# Altium schematic sheet STM32F7.SchDoc: STM32F723e Connexion
size A3; Author: N.P; CompanyName: STMicroelectronics; Organization: MCD/APPLIS/LMS; DocumentNumber: 4; SheetNumber: 4; SheetTotal: 13; Project: STM32F723e-DISCO
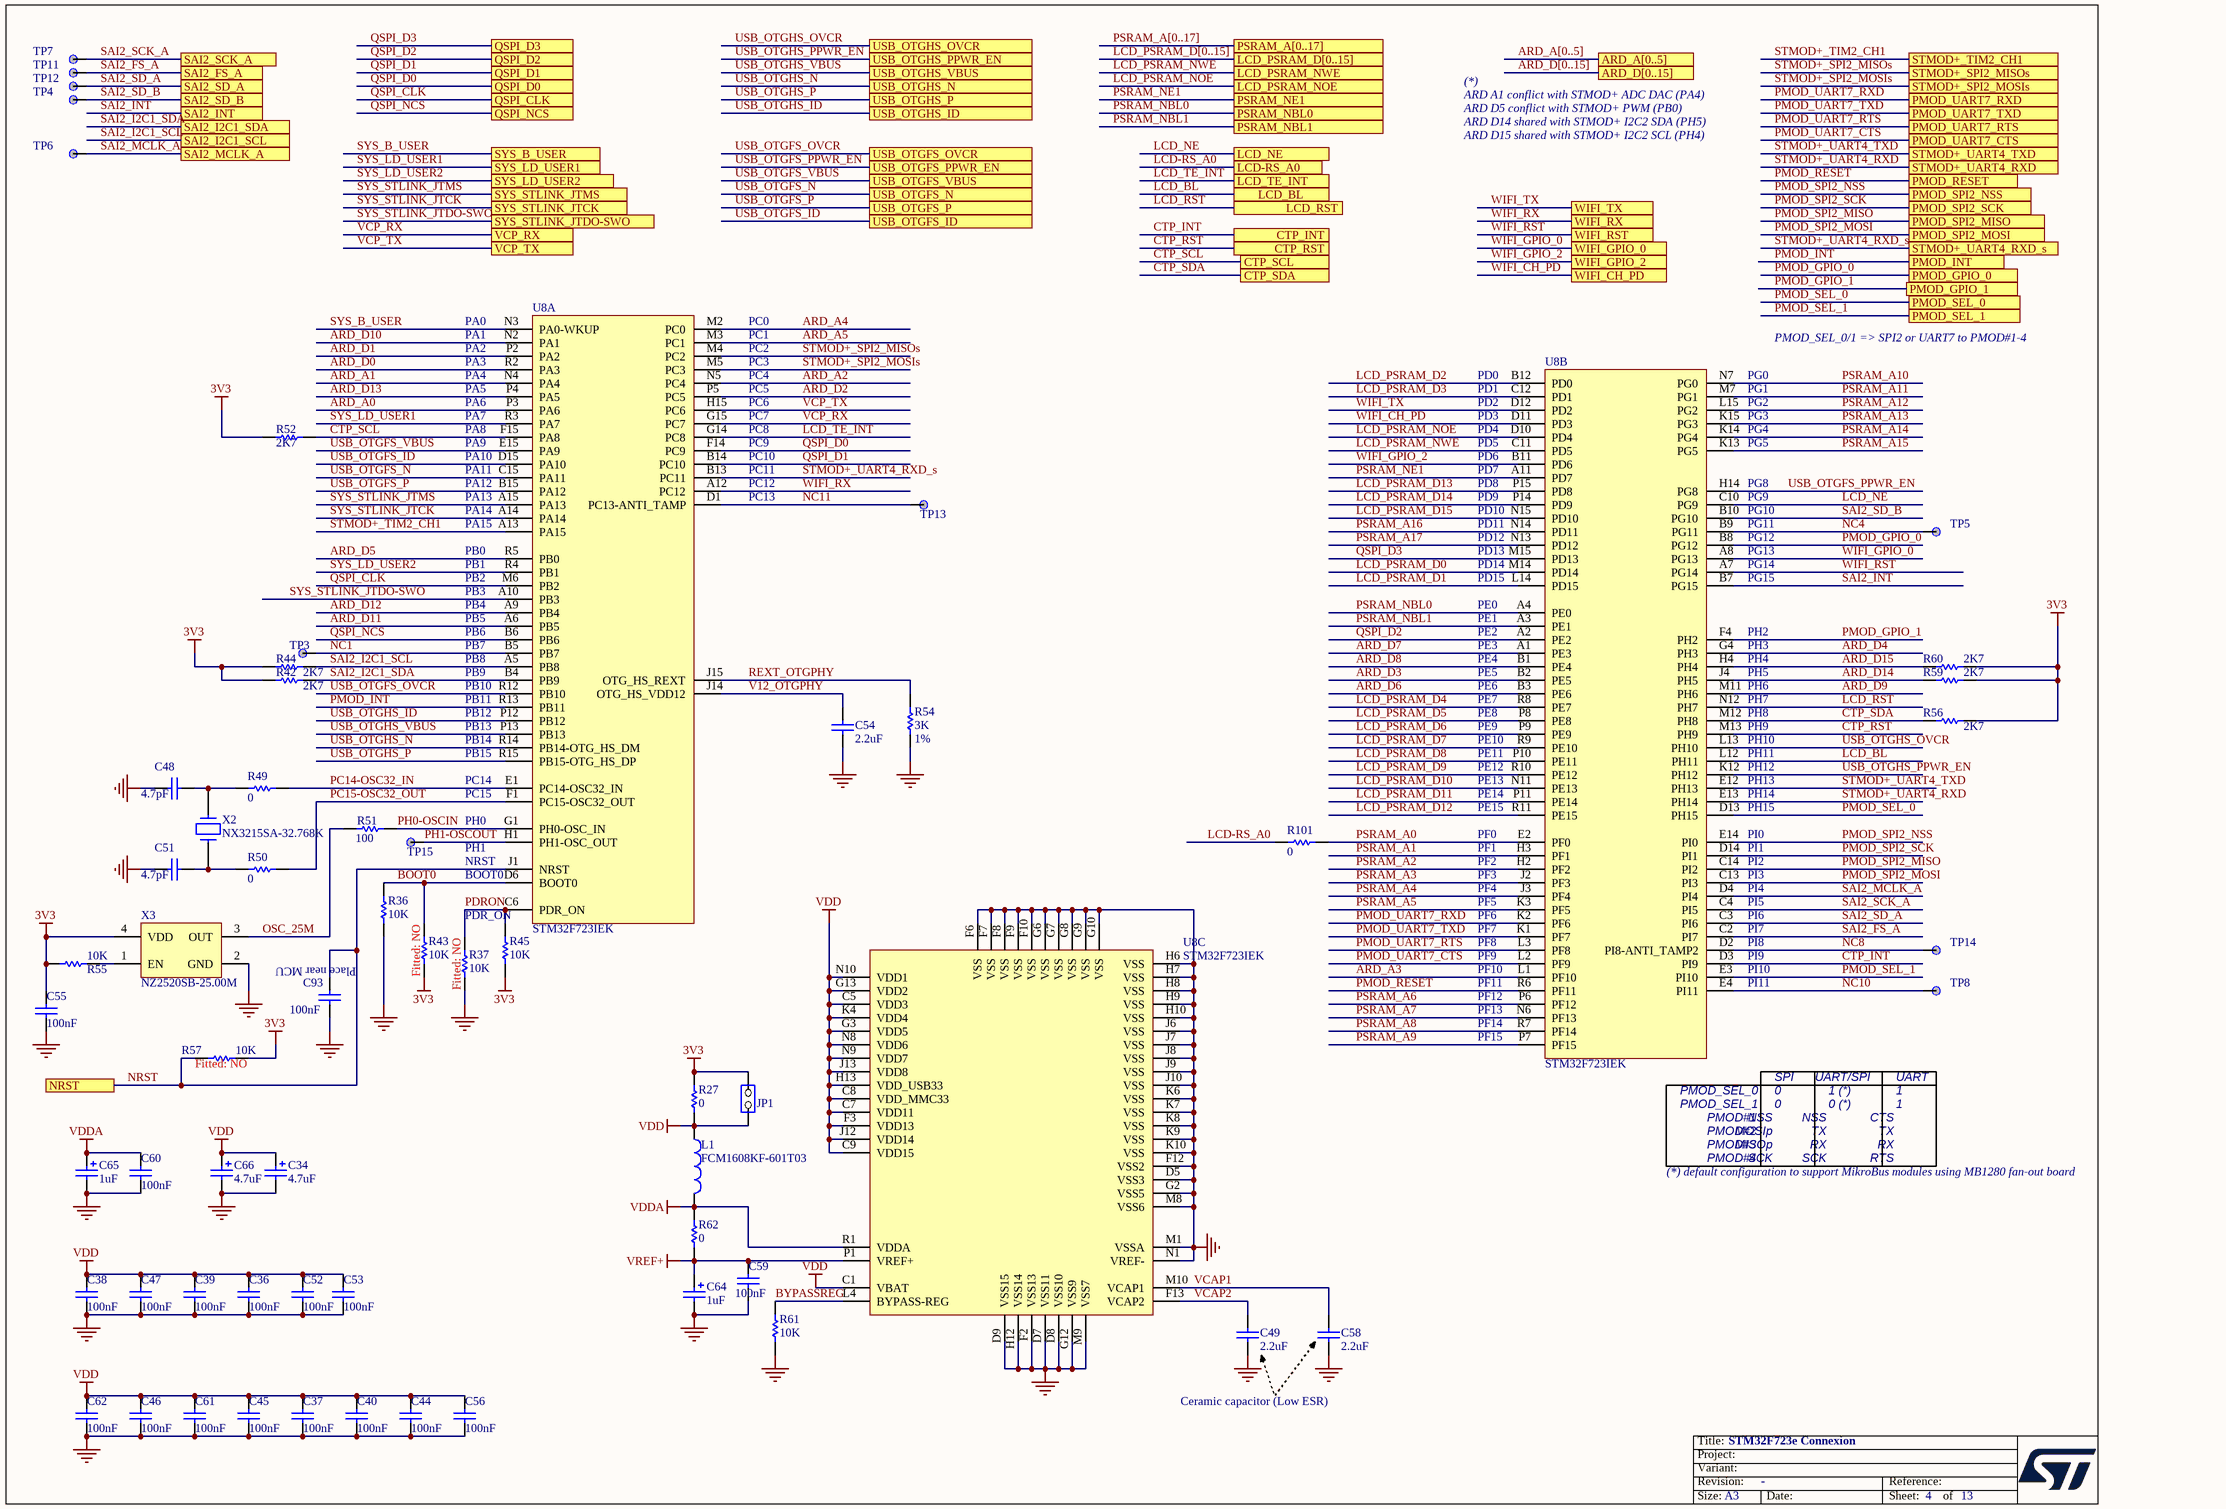
[diagram p0: STM32F7.SchDoc]

## Parts
C34  4.7uF  [TAN-A]
C36  100nF  [0402C]
C37  100nF  [0402C]
C38  100nF  [0402C]
C39  100nF  [0402C]
C40  100nF  [0402C]
C44  100nF  [0402C]
C45  100nF  [0402C]
C46  100nF  [0402C]
C47  100nF  [0402C]
C48  value 4.7pF  [0402C]  (hidden comment: 4.7pF_NPO_-+0.25pF_0402)
C49  2.2uF  [1206C]
C51  value 4.7pF  [0402C]  (hidden comment: 4.7pF_NPO_-+0.25pF_0402)
C52  100nF  [0402C]
C53  100nF  [0402C]
C54  value 2.2uF  [0603C]  (hidden comment: 2.2uF_X5R_10%_0603)
C55  100nF  [0402C]
C56  100nF  [0402C]
C58  2.2uF  [1206C]
C59  100nF  [0402C]
C60  100nF  [0402C]
C61  100nF  [0402C]
C62  100nF  [0402C]
C64  1uF  [TAN-A]
C65  1uF  [TAN-A]
C66  4.7uF  [TAN-A]
C93  100nF  [0402C]
JP1  JP2  [SIP2]  (value not drawn)
L1  FCM1608KF-601T03  [0603L]
R27  value 0  [0603R-GS]  (hidden comment: 0_5%_0603)
R36  10K  [0402R]
R37  Fitted: NO  [0402R]  (hidden comment: 10K)
R42  2K7  [0402R]
R43  Fitted: NO  [0402R]  (hidden comment: 10K)
R44  2K7  [0402R]
R45  10K  [0402R]
R49  0  [0402R]
R50  0  [0402R]
R51  100  [0402R]
R52  2K7  [0402R]
R54  3K  Tolerance: 1%  [0402R]
R55  10K  [0402R]
R56  2K7  [0402R]
R57  Fitted: NO  [0402R]  (hidden comment: 10K)
R59  2K7  [0402R]
R60  2K7  [0402R]
R61  10K  [0402R]
R62  value 0  [0603R-GS]  (hidden comment: 0_5%_0603)
R101  0  [0402R]
TP3  TP  [TP_C40]  (value not drawn)
TP4  TP  [TP_C40]  (value not drawn)
TP5  TP  [TP_C40]  (value not drawn)
TP6  TP  [TP_C40]  (value not drawn)
TP7  TP  [TP_C40]  (value not drawn)
TP8  TP  [TP_C40]  (value not drawn)
TP11  TP  [TP_C40]  (value not drawn)
TP12  TP  [TP_C40]  (value not drawn)
TP13  TP  [TP_C40]  (value not drawn)
TP14  TP  [TP_C40]  (value not drawn)
TP15  TP  [TP_C40]  (value not drawn)
U8  STM32F723IEK  [BGA176_0R65_10x10]  (parts A,B,C of 3)
X2  NX3215SA-32.768K  [XTAL_2SM_3R2X1R5]
X3  NZ2520SB-25.00M  [OSC_4SM_2R5X2]

## Ports
ARD_A[0..5], ARD_D[0..15], CTP_INT, CTP_RST, CTP_SCL, CTP_SDA, LCD-RS_A0, LCD_BL, LCD_NE, LCD_PSRAM_D[0..15], LCD_PSRAM_NOE, LCD_PSRAM_NWE, LCD_RST, LCD_TE_INT, NRST, PMOD_GPIO_0, PMOD_GPIO_1, PMOD_INT, PMOD_RESET, PMOD_SEL_0, PMOD_SEL_1, PMOD_SPI2_MISO, PMOD_SPI2_MOSI, PMOD_SPI2_NSS, PMOD_SPI2_SCK, PMOD_UART7_CTS, PMOD_UART7_RTS, PMOD_UART7_RXD, PMOD_UART7_TXD, PSRAM_A[0..17], PSRAM_NBL0, PSRAM_NBL1, PSRAM_NE1, QSPI_CLK, QSPI_D0, QSPI_D1, QSPI_D2, QSPI_D3, QSPI_NCS, SAI2_FS_A, SAI2_I2C1_SCL, SAI2_I2C1_SDA, SAI2_INT, SAI2_MCLK_A, SAI2_SCK_A, SAI2_SD_A, SAI2_SD_B, STMOD+_SPI2_MISOs, STMOD+_SPI2_MOSIs, STMOD+_TIM2_CH1, STMOD+_UART4_RXD, STMOD+_UART4_RXD_s, STMOD+_UART4_TXD, SYS_B_USER, SYS_LD_USER1, SYS_LD_USER2, SYS_STLINK_JTCK, SYS_STLINK_JTDO-SWO, SYS_STLINK_JTMS, USB_OTGFS_ID, USB_OTGFS_N, USB_OTGFS_OVCR, USB_OTGFS_P, USB_OTGFS_PPWR_EN, USB_OTGFS_VBUS, USB_OTGHS_ID, USB_OTGHS_N, USB_OTGHS_OVCR, USB_OTGHS_P, USB_OTGHS_PPWR_EN, USB_OTGHS_VBUS, VCP_RX, VCP_TX, WIFI_CH_PD, WIFI_GPIO_0, WIFI_GPIO_2, WIFI_RST, WIFI_RX, WIFI_TX

## Nets
3V3: C55.2 JP1.2(NO) R27.2 R42.1 R43.1 R44.1 R45.1 R52.1 R55.1 R56.2 R57.2 R59.2 R60.2 X3.4(VDD)
GND: C34.2 C36.1 C37.1 C38.1 C39.1 C40.1 C44.1 C45.1 C46.1 C47.1 C48.1 C49.1 C51.1 C52.1 C53.1 C54.1 C55.1 C56.1 C58.1 C59.1 C60.1 C61.1 C62.1 C64.2 C65.2 C66.2 C93.1 R36.1 R37.1 R54.1 R61.1 U8.D5(VSS3) U8.D7(VSS11) U8.D8(VSS10) U8.D9(VSS15) U8.F2(VSS13) U8.F6(VSS) U8.F7(VSS) U8.F8(VSS) U8.F9(VSS) U8.F10(VSS) U8.F12(VSS2) U8.G2(VSS5) U8.G6(VSS) U8.G7(VSS) U8.G8(VSS) U8.G9(VSS) U8.G10(VSS) U8.G12(VSS9) U8.H6(VSS) U8.H7(VSS) U8.H8(VSS) U8.H9(VSS) U8.H10(VSS) U8.H12(VSS14) U8.J6(VSS) U8.J7(VSS) U8.J8(VSS) U8.J9(VSS) U8.J10(VSS) U8.K6(VSS) U8.K7(VSS) U8.K8(VSS) U8.K9(VSS) U8.K10(VSS) U8.M1(VSSA) U8.M8(VSS6) U8.M9(VSS7) U8.N1(VREF-) X3.2(GND)
VDD: C34.1 C36.2 C37.2 C38.2 C39.2 C40.2 C44.2 C45.2 C46.2 C47.2 C52.2 C53.2 C56.2 C61.2 C62.2 C66.1 JP1.1(COMMON) L1.1 R27.1 U8.C1(VBAT) U8.C5(VDD3) U8.C7(VDD11) U8.C8(VDD_MMC33) U8.C9(VDD15) U8.F3(VDD13) U8.G3(VDD5) U8.G13(VDD2) U8.H13(VDD_USB33) U8.J12(VDD14) U8.J13(VDD8) U8.K4(VDD4) U8.N8(VDD6) U8.N9(VDD7) U8.N10(VDD1)
VDDA: C60.2 C65.1 L1.2 R62.2 U8.R1(VDDA)
VREF+: C59.2 C64.1 R62.1 U8.P1(VREF+)
ARD_A0: U8.P3(PA6)
ARD_A1: U8.N4(PA4)
ARD_A2: U8.N5(PC4)
ARD_A3: U8.L1(PF10)
ARD_A4: U8.M2(PC0)
ARD_A5: U8.M3(PC1)
ARD_D0: U8.R2(PA3)
ARD_D1: U8.P2(PA2)
ARD_D2: U8.P5(PC5)
ARD_D3: U8.B2(PE5)
ARD_D4: U8.G4(PH3)
ARD_D5: U8.R5(PB0)
ARD_D6: U8.B3(PE6)
ARD_D7: U8.A1(PE3)
ARD_D8: U8.B1(PE4)
ARD_D9: U8.M11(PH6)
ARD_D10: U8.N2(PA1)
ARD_D11: U8.A6(PB5)
ARD_D12: U8.A9(PB4)
ARD_D13: U8.P4(PA5)
ARD_D14: R59.1 U8.J4(PH5)
ARD_D15: R60.1 U8.H4(PH4)
BOOT0: R36.2 R43.2 U8.D6(BOOT0)
BYPASSREG: R61.2 U8.L4(BYPASS-REG)
CTP_INT: U8.D3(PI9) ; port CTP_INT
CTP_RST: U8.M13(PH9) ; port CTP_RST
CTP_SCL: R52.2 U8.F15(PA8) ; port CTP_SCL
CTP_SDA: R56.1 U8.M12(PH8) ; port CTP_SDA
LCD-RS_A0: R101.2 ; port LCD-RS_A0
LCD_BL: U8.L12(PH11) ; port LCD_BL
LCD_NE: U8.C10(PG9) ; port LCD_NE
LCD_PSRAM_D0: U8.M14(PD14)
LCD_PSRAM_D1: U8.L14(PD15)
LCD_PSRAM_D2: U8.B12(PD0)
LCD_PSRAM_D3: U8.C12(PD1)
LCD_PSRAM_D4: U8.R8(PE7)
LCD_PSRAM_D5: U8.P8(PE8)
LCD_PSRAM_D6: U8.P9(PE9)
LCD_PSRAM_D7: U8.R9(PE10)
LCD_PSRAM_D8: U8.P10(PE11)
LCD_PSRAM_D9: U8.R10(PE12)
LCD_PSRAM_D10: U8.N11(PE13)
LCD_PSRAM_D11: U8.P11(PE14)
LCD_PSRAM_D12: U8.R11(PE15)
LCD_PSRAM_D13: U8.P15(PD8)
LCD_PSRAM_D14: U8.P14(PD9)
LCD_PSRAM_D15: U8.N15(PD10)
LCD_PSRAM_NOE: U8.D10(PD4) ; port LCD_PSRAM_NOE
LCD_PSRAM_NWE: U8.C11(PD5) ; port LCD_PSRAM_NWE
LCD_RST: U8.N12(PH7) ; port LCD_RST
LCD_TE_INT: U8.G14(PC8) ; port LCD_TE_INT
NC1: TP3.1 U8.B5(PB7)
NC4: TP5.1 U8.B9(PG11)
NC8: TP14.1 U8.D2(PI8-ANTI_TAMP2)
NC10: TP8.1 U8.E4(PI11)
NC11: TP13.1 U8.D1(PC13-ANTI_TAMP)
NRST: C93.2 R57.1 U8.J1(NRST) ; port NRST
OSC_25M: R51.1 X3.3(OUT)
PC14-OSC32_IN: R49.2 U8.E1(PC14-OSC32_IN)
PC15-OSC32_OUT: R50.2 U8.F1(PC15-OSC32_OUT)
PDRON: R37.2 R45.2 U8.C6(PDR_ON)
PH0-OSCIN: R51.2 U8.G1(PH0-OSC_IN)
PH1-OSCOUT: TP15.1 U8.H1(PH1-OSC_OUT)
PMOD_GPIO_0: U8.B8(PG12) ; port PMOD_GPIO_0
PMOD_GPIO_1: U8.F4(PH2) ; port PMOD_GPIO_1
PMOD_INT: U8.R13(PB11) ; port PMOD_INT
PMOD_RESET: U8.R6(PF11) ; port PMOD_RESET
PMOD_SEL_0: U8.D13(PH15) ; port PMOD_SEL_0
PMOD_SEL_1: U8.E3(PI10) ; port PMOD_SEL_1
PMOD_SPI2_MISO: U8.C14(PI2) ; port PMOD_SPI2_MISO
PMOD_SPI2_MOSI: U8.C13(PI3) ; port PMOD_SPI2_MOSI
PMOD_SPI2_NSS: U8.E14(PI0) ; port PMOD_SPI2_NSS
PMOD_SPI2_SCK: U8.D14(PI1) ; port PMOD_SPI2_SCK
PMOD_UART7_CTS: U8.L2(PF9) ; port PMOD_UART7_CTS
PMOD_UART7_RTS: U8.L3(PF8) ; port PMOD_UART7_RTS
PMOD_UART7_RXD: U8.K2(PF6) ; port PMOD_UART7_RXD
PMOD_UART7_TXD: U8.K1(PF7) ; port PMOD_UART7_TXD
PSRAM_A0: R101.1 U8.E2(PF0)
PSRAM_A1: U8.H3(PF1)
PSRAM_A2: U8.H2(PF2)
PSRAM_A3: U8.J2(PF3)
PSRAM_A4: U8.J3(PF4)
PSRAM_A5: U8.K3(PF5)
PSRAM_A6: U8.P6(PF12)
PSRAM_A7: U8.N6(PF13)
PSRAM_A8: U8.R7(PF14)
PSRAM_A9: U8.P7(PF15)
PSRAM_A10: U8.N7(PG0)
PSRAM_A11: U8.M7(PG1)
PSRAM_A12: U8.L15(PG2)
PSRAM_A13: U8.K15(PG3)
PSRAM_A14: U8.K14(PG4)
PSRAM_A15: U8.K13(PG5)
PSRAM_A16: U8.N14(PD11)
PSRAM_A17: U8.N13(PD12)
PSRAM_NBL0: U8.A4(PE0) ; port PSRAM_NBL0
PSRAM_NBL1: U8.A3(PE1) ; port PSRAM_NBL1
PSRAM_NE1: U8.A11(PD7) ; port PSRAM_NE1
QSPI_CLK: U8.M6(PB2) ; port QSPI_CLK
QSPI_D0: U8.F14(PC9) ; port QSPI_D0
QSPI_D1: U8.B14(PC10) ; port QSPI_D1
QSPI_D2: U8.A2(PE2) ; port QSPI_D2
QSPI_D3: U8.M15(PD13) ; port QSPI_D3
QSPI_NCS: U8.B6(PB6) ; port QSPI_NCS
REXT_OTGPHY: R54.2 U8.J15(OTG_HS_REXT)
SAI2_FS_A: TP11.1 U8.C2(PI7) ; port SAI2_FS_A
SAI2_I2C1_SCL: R44.2 U8.A5(PB8) ; port SAI2_I2C1_SCL
SAI2_I2C1_SDA: R42.2 U8.B4(PB9) ; port SAI2_I2C1_SDA
SAI2_INT: U8.B7(PG15) ; port SAI2_INT
SAI2_MCLK_A: TP6.1 U8.D4(PI4) ; port SAI2_MCLK_A
SAI2_SCK_A: TP7.1 U8.C4(PI5) ; port SAI2_SCK_A
SAI2_SD_A: TP12.1 U8.C3(PI6) ; port SAI2_SD_A
SAI2_SD_B: TP4.1 U8.B10(PG10) ; port SAI2_SD_B
STMOD+_SPI2_MISOs: U8.M4(PC2) ; port STMOD+_SPI2_MISOs
STMOD+_SPI2_MOSIs: U8.M5(PC3) ; port STMOD+_SPI2_MOSIs
STMOD+_TIM2_CH1: U8.A13(PA15) ; port STMOD+_TIM2_CH1
STMOD+_UART4_RXD: U8.E13(PH14) ; port STMOD+_UART4_RXD
STMOD+_UART4_RXD_s: U8.B13(PC11) ; port STMOD+_UART4_RXD_s
STMOD+_UART4_TXD: U8.E12(PH13) ; port STMOD+_UART4_TXD
SYS_B_USER: U8.N3(PA0-WKUP) ; port SYS_B_USER
SYS_LD_USER1: U8.R3(PA7) ; port SYS_LD_USER1
SYS_LD_USER2: U8.R4(PB1) ; port SYS_LD_USER2
SYS_STLINK_JTCK: U8.A14(PA14) ; port SYS_STLINK_JTCK
SYS_STLINK_JTDO-SWO: U8.A10(PB3) ; port SYS_STLINK_JTDO-SWO
SYS_STLINK_JTMS: U8.A15(PA13) ; port SYS_STLINK_JTMS
USB_OTGFS_ID: U8.D15(PA10) ; port USB_OTGFS_ID
USB_OTGFS_N: U8.C15(PA11) ; port USB_OTGFS_N
USB_OTGFS_OVCR: U8.R12(PB10) ; port USB_OTGFS_OVCR
USB_OTGFS_P: U8.B15(PA12) ; port USB_OTGFS_P
USB_OTGFS_PPWR_EN: U8.H14(PG8) ; port USB_OTGFS_PPWR_EN
USB_OTGFS_VBUS: U8.E15(PA9) ; port USB_OTGFS_VBUS
USB_OTGHS_ID: U8.P12(PB12) ; port USB_OTGHS_ID
USB_OTGHS_N: U8.R14(PB14-OTG_HS_DM) ; port USB_OTGHS_N
USB_OTGHS_OVCR: U8.L13(PH10) ; port USB_OTGHS_OVCR
USB_OTGHS_P: U8.R15(PB15-OTG_HS_DP) ; port USB_OTGHS_P
USB_OTGHS_PPWR_EN: U8.K12(PH12) ; port USB_OTGHS_PPWR_EN
USB_OTGHS_VBUS: U8.P13(PB13) ; port USB_OTGHS_VBUS
V12_OTGPHY: C54.2 U8.J14(OTG_HS_VDD12)
VCAP1: C58.2 U8.M10(VCAP1)
VCAP2: C49.2 U8.F13(VCAP2)
VCP_RX: U8.G15(PC7) ; port VCP_RX
VCP_TX: U8.H15(PC6) ; port VCP_TX
WIFI_CH_PD: U8.D11(PD3) ; port WIFI_CH_PD
WIFI_GPIO_0: U8.A8(PG13) ; port WIFI_GPIO_0
WIFI_GPIO_2: U8.B11(PD6) ; port WIFI_GPIO_2
WIFI_RST: U8.A7(PG14) ; port WIFI_RST
WIFI_RX: U8.A12(PC12) ; port WIFI_RX
WIFI_TX: U8.D12(PD2) ; port WIFI_TX
NetC48_2: C48.2 R49.1 X2.1
NetC51_2: C51.2 R50.1 X2.2
NetR55_2: R55.2 X3.1(EN)

## Buses and harness runs
bus ARD_A[0..5] = port ARD_A[0..5]
bus ARD_D[0..15] = port ARD_D[0..15]
bus LCD_PSRAM_D[0..15] = port LCD_PSRAM_D[0..15]
bus PSRAM_A[0..17] = port PSRAM_A[0..17]

## Notes on the sheet
- (*)
  ARD A1 conflict with STMOD+ ADC DAC (PA4)
  ARD D5 conflict with STMOD+ PWM (PB0)
  ARD D14 shared with STMOD+ I2C2 SDA (PH5)
  ARD D15 shared with STMOD+ I2C2 SCL (PH4)
- (near U8) PA0
- (near U8) PA1
- (near U8) PA2
- (near U8) PA3
- (near U8) PA4
- PC0
- PC1
- PC2
- PC3
- PC4
- (near U8) PD0
- (near U8) PG0
- PMOD_SEL_0/1 => SPI2 or UART7 to PMOD#1-4
- (near U8) PA5
- (near U8) PA6
- (near U8) PA7
- (near U8) PA8
- (near U8) PA9
- PC5
- PC6
- PC7
- PC8
- PC9
- (near U8) PD1
- (near U8) PD2
- (near U8) PD3
- (near U8) PD4
- (near U8) PD5
- (near U8) PG1
- (near U8) PG2
- (near U8) PG3
- (near U8) PG4
- (near U8) PG5
- (near U8) PA10
- (near U8) PA11
- (near U8) PA12
- (near U8) PA13
- (near U8) PA14
- PC10
- PC11
- PC12
- PC13
- (near U8) PD6
- (near U8) PD7
- (near U8) PD8
- (near U8) PD9
- (near U8) PD10
- (near U8) PG8
- (near U8) PG9
- (near U8) PG10
- (near U8) PA15
- (near U8) PB0
- (near U8) PB1
- (near U8) PB2
- (near U8) PD11
- (near U8) PD12
- (near U8) PD13
- (near U8) PD14
- (near U8) PD15
- (near U8) PG11
- (near U8) PG12
- (near U8) PG13
- (near U8) PG14
- (near U8) PG15
- (near U8) PB3
- (near U8) PB4
- (near U8) PB5
- (near U8) PB6
- (near U8) PB7
- (near U8) PE0
- (near U8) PE1
- (near U8) PE2
- (near U8) PE3
- (near U8) PH2
- (near U8) PH3
- (near U8) PB8
- (near U8) PB9
- (near U8) PB10
- (near U8) PB11
- (near U8) PB12
- (near U8) PE4
- (near U8) PE5
- (near U8) PE6
- (near U8) PE7
- (near U8) PE8
- (near U8) PH4
- (near U8) PH5
- (near U8) PH6
- (near U8) PH7
- (near U8) PH8
- (near U8) PB13
- (near U8) PB14
- (near U8) PB15
- (near U8) PC14
- (near U8) PE9
- (near U8) PE10
- (near U8) PE11
- (near U8) PE12
- (near U8) PE13
- (near U8) PH9
- (near U8) PH10
- (near U8) PH11
- (near U8) PH12
- (near U8) PH13
- PC15
- PH0
- PH1
- (near U8) PE14
- (near U8) PE15
- (near U8) PF0
- (near U8) PF1
- (near U8) PH14
- (near U8) PH15
- (near U8) PI0
- (near U8) PI1
- NRST
- BOOT0
- (near R45) PDR_ON
- (near U8) PF2
- (near U8) PF3
- (near U8) PF4
- (near U8) PF5
- (near U8) PF6
- (near U8) PI2
- (near U8) PI3
- (near U8) PI4
- (near U8) PI5
- (near U8) PI6
- (near C93) Place near MCU
- (near U8) PF7
- (near U8) PF8
- (near U8) PF9
- (near U8) PF10
- (near U8) PF11
- (near U8) PI7
- (near U8) PI8
- (near U8) PI9
- (near U8) PI10
- (near U8) PI11
- (near U8) PF12
- (near U8) PF13
- (near U8) PF14
- (near U8) PF15
- (near U8) PMOD_SEL_0
- PMOD_SEL_1
- PMOD#1
- 0
- NSS
- SPI
- UART/SPI
- 0 (*)
- 1 (*)
- CTS
- UART
- 1
- (*) default configuration to support MikroBus modules using MB1280 fan-out board
- PMOD#2
- PMOD#3
- PMOD#4
- MOSIp
- MISOp
- SCK
- TX
- RX
- RTS
- Ceramic capacitor (Low ESR)
- Title:
- Project:
- Size:
- Revision:
- Variant:
- A3
- -
- Date:
- Reference:
- Sheet:
- of

## Library data of the parts
C34 C66 = Cap_4.7uF_POL_10%_TANA: Polarized Capacitor,4.7uF,16V,10%,typeA,AVX; Manuf_Part_1: TAJA475K016R; Ordered by: Subcon; Fitted: YES; Revision: July-2002: Re-released for DXP Platform.; Value: 4.7uF; Manuf_1: AVX; Order: TAJA475K016R; ECCN_US/EU: n/a
C36-C40 C44-C47 C52 C53 C55 C56 C59-C62 C93 = Cap_100nF_X7R_10%_0402: Capacitor,100nF,16V,X7R,10%,0402,YAGEO; Manuf_Part_1: CC0402KRX7R7BB104; Ordered by: Subcon; Fitted: YES; Revision: July-2002: Re-released for DXP Platform.; Value: 100nF; Order: CC0402KRX7R7BB104; Manuf_1: YAGEO; ECCN_US/EU: n/a
C48 C51 = Cap_4.7pF_NPO_-+0.25pF_0402: Capacitor, 4.7pF, 50V, NPO, -+0.25pF, 0402, YAGEO; Manuf_Part_1: CC0402CRNPO9BN4R7; Order: 311-1633-2-ND; Ordered by: Subcon; Fitted: YES; Revision: July-2002: Re-released for DXP Platform.; Manuf_1: YAGEO; ECCN_US/EU: n/a; Distrib: DIGIKEY
C49 C58 = Cap_2.2uF_X7R_10%_1206: Capacitor,2.2uF,16V, X7R,10%,1206,YAGEO; Manuf_Part_1: CC1206KKX7R7BB225; Manuf_Part_2: C1206C225K4RAC; Manuf_2: KEMET; Ordered by: Subcon; Fitted: YES; Revision: July-2002: Re-released for DXP Platform.; Value: 2.2uF; Order: CC1206KKX7R7BB225; Manuf_1: YAGEO; ECCN_US/EU: n/a
C54 = Cap_2.2uF_X5R_10%_0603: Capacitor,2.2uF,10V, X5R,10%,0603,YAGEO; Manuf_Part_1: CC0603KRX5R6BB225; Manuf_Part_2: C0603C225K8PACTU; Manuf_2: KEMET; Ordered by: Subcon; Fitted: YES; Revision: July-2002: Re-released for DXP Platform.; Order: *; Manuf_1: YAGEO; ECCN_US/EU: n/a
C64 C65 = Cap_1uF_POL_10%_TANA: Polarized Capacitor,1uF,16V,10%,typeA,AVX; Manuf_Part_1: TAJA105K016R; Ordered by: Subcon; Fitted: YES; Revision: July-2002: Re-released for DXP Platform.; Value: 1uF; Manuf_1: AVX; Distrib: *; Order: TAJA105K016R; ECCN_US/EU: n/a
JP1 = JP2: Fitted: NO; Ordered by: Subcon; ECCN_US/EU: n/a
L1 = BEAD_600R_350MA_0603: Bead,600R,350mA,0603,FCM1608KF-601T03,Tai-tech; Manuf_2: TDK; Manuf_Part_2: MPZ1608S300A; Manuf_Part_3: BLM18PG121SN1D; Manuf_3: MURATA; Value: 100uH; Description_2: Bead,30R,5A,0603,MPZ1608S300A,TDK; Description_3: Bead,120R,2A,0603,BLM18PG121SN1D,MURATA; Ordered by: Subcon; Fitted: YES; Revision: July-2002: Re-released for DXP Platform.; Manuf_Part_1: FCM1608KF-601T03; Manuf_1: Tai-tech; ECCN_US/EU: n/a
R27 R62 = Res_0_5%_0603: Resistor,0,0603,5%,YAGEO; Manuf_Part_1: RC0603JR-070RL; Order: 2363481; Ordered by: Subcon; Fitted: YES; ECCN_US/EU: n/a; Manuf_1: YAGEO; Distrib: FARNELL
R36 R45 R55 R61 = Res_10K_1%_0402: Resistor,10K,0402,1%,YAGEO; Manuf_Part_1: RC0402FR-0710KL; Ordered by: Subcon; Fitted: YES; Value: 10K; Manuf_1: YAGEO; Order: RC0402FR-0710KL; ECCN_US/EU: n/a
R37 R43 R57 = Res_10K_1%_0402: Resistor,10K,0402,1%,YAGEO; Manuf_Part_1: RC0402FR-0710KL; Ordered by: Subcon; Value: 10K; Manuf_1: YAGEO; Order: RC0402FR-0710KL; ECCN_US/EU: n/a
R42 R44 R52 R56 R59 R60 = Res_2K7_1%_0402: Resistor,2K7,0402,1%,YAGEO; Manuf_Part_1: RC0402FR-072K7L; Ordered by: Subcon; Fitted: YES; Value: 2K7; Manuf_1: YAGEO; Order: RC0402FR-072K7L; ECCN_US/EU: n/a; Distrib: FARNELL
R49 R50 R101 = Res_0_5%_0402: Resistor,0,0402,5%,YAGEO; Manuf_Part_1: RC0402JR-070RL; Order: 2363467; Ordered by: Subcon; Fitted: YES; Value: 0; ECCN_US/EU: n/a; Manuf_1: YAGEO; Distrib: FARNELL
R51 = Res_100_1%_0402: Resistor,100,0402,1%,YAGEO; Manuf_Part_1: RC0402FR-07100RL; Order: 9239111; Ordered by: Subcon; Fitted: YES; Value: 100; Manuf_1: YAGEO; ECCN_US/EU: n/a; Distrib: FARNELL
R54 = Res_3K_1%_0402: Resistor 3K 0402 1% YAGEO; Manuf_Part_1: RC0402FR-073KL; Ordered by: Subcon; Fitted: YES; Value: 3K; Manuf_1: YAGEO; Order: RC0402FR-073KL; ECCN_US/EU: n/a
TP3-TP8 TP11-TP15 = TP: Test Point; Fitted: NO; Ordered by: Subcon; ECCN_US/EU: n/a
U8 = STM32F723IEK: STM32F723IEK  (STM32F7 LittleBirdie) BGA176; Manuf_1: STM; Fitted: YES; Ordered by: ST; Manuf_Part_1: STM32F723IEK
X2 = XTAL_32K_NX3215SA: Crystal 32.768kHz, 6pF, -+20PPM, R=50K, SMD; Manuf_1: NDK; Manuf_Part_1: NX3215SA 32.768KHz EXS00A-MU00525; ECCN_US/EU: EAR99/NEC; Ref St: 9157034; NDK Ref: X3101802; Provided: ST; Fitted: YES; Distrib: *; Order: NX3215SA 32.768KHz EXS00A-MU00525; Ordered by: ST
X3 = OSC_25M_NZ2520SB: Oscillator 25.00Mhz, -+50PPM, 3.3V, Temp -55 to +125°C; Manuf_Part_1: NZ2520SB 25MHz END4869B; Manuf_1: NDK; Manuf_Part_2: KC2520B25.0000C10E00; Manuf_2: AVX Corp/Kyocera Corp; ECCN_US/EU: EAR99/NEC; Ref St: 9157031; Provided: ST; Fitted: YES; Order: *; Ordered by: ST